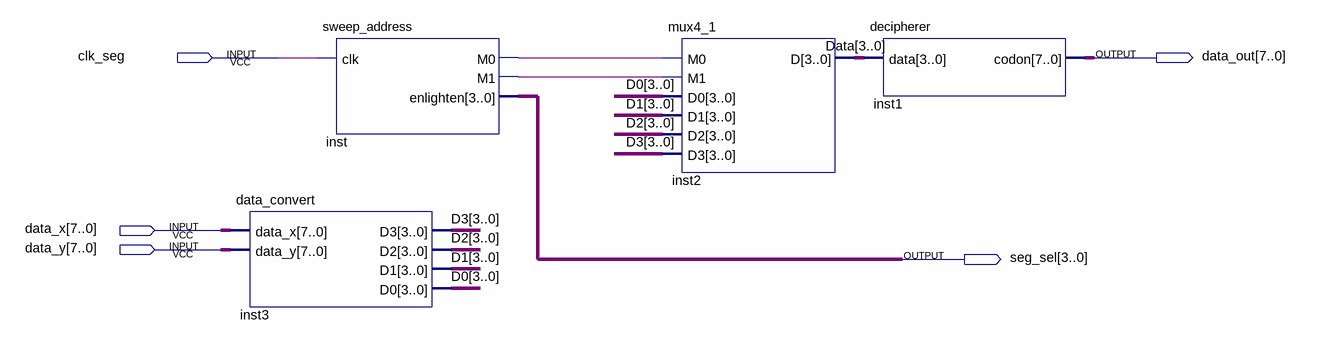
[diagram p0: schematic sheet]
// Quartus schematic seg.bdf as structural Verilog: 4 symbols, 5 pins
module seg (
  input  clk_seg,
  input  [7:0] data_x,
  input  [7:0] data_y,
  output [7:0] data_out,
  output [3:0] seg_sel
);

  wire inst_m0, inst_m1;
  wire [3:0] D0, D1, D2, D3, Data;

  data_convert inst3 (.data_x(data_x), .data_y(data_y), .D3(D3), .D2(D2), .D1(D1), .D0(D0));
  sweep_address inst (.clk(clk_seg), .M0(inst_m0), .M1(inst_m1), .enlighten(seg_sel));
  mux4_1 inst2 (.M0(inst_m0), .M1(inst_m1), .D0(D0), .D1(D1), .D2(D2), .D3(D3), .D(Data));
  decipherer inst1 (.data(Data), .codon(data_out));
endmodule
